# EasyEDA Pro project 前置放大.eprj

# Schematic Schematic1
Board Name: 前置差分放大; Create Date: 2024-09-15
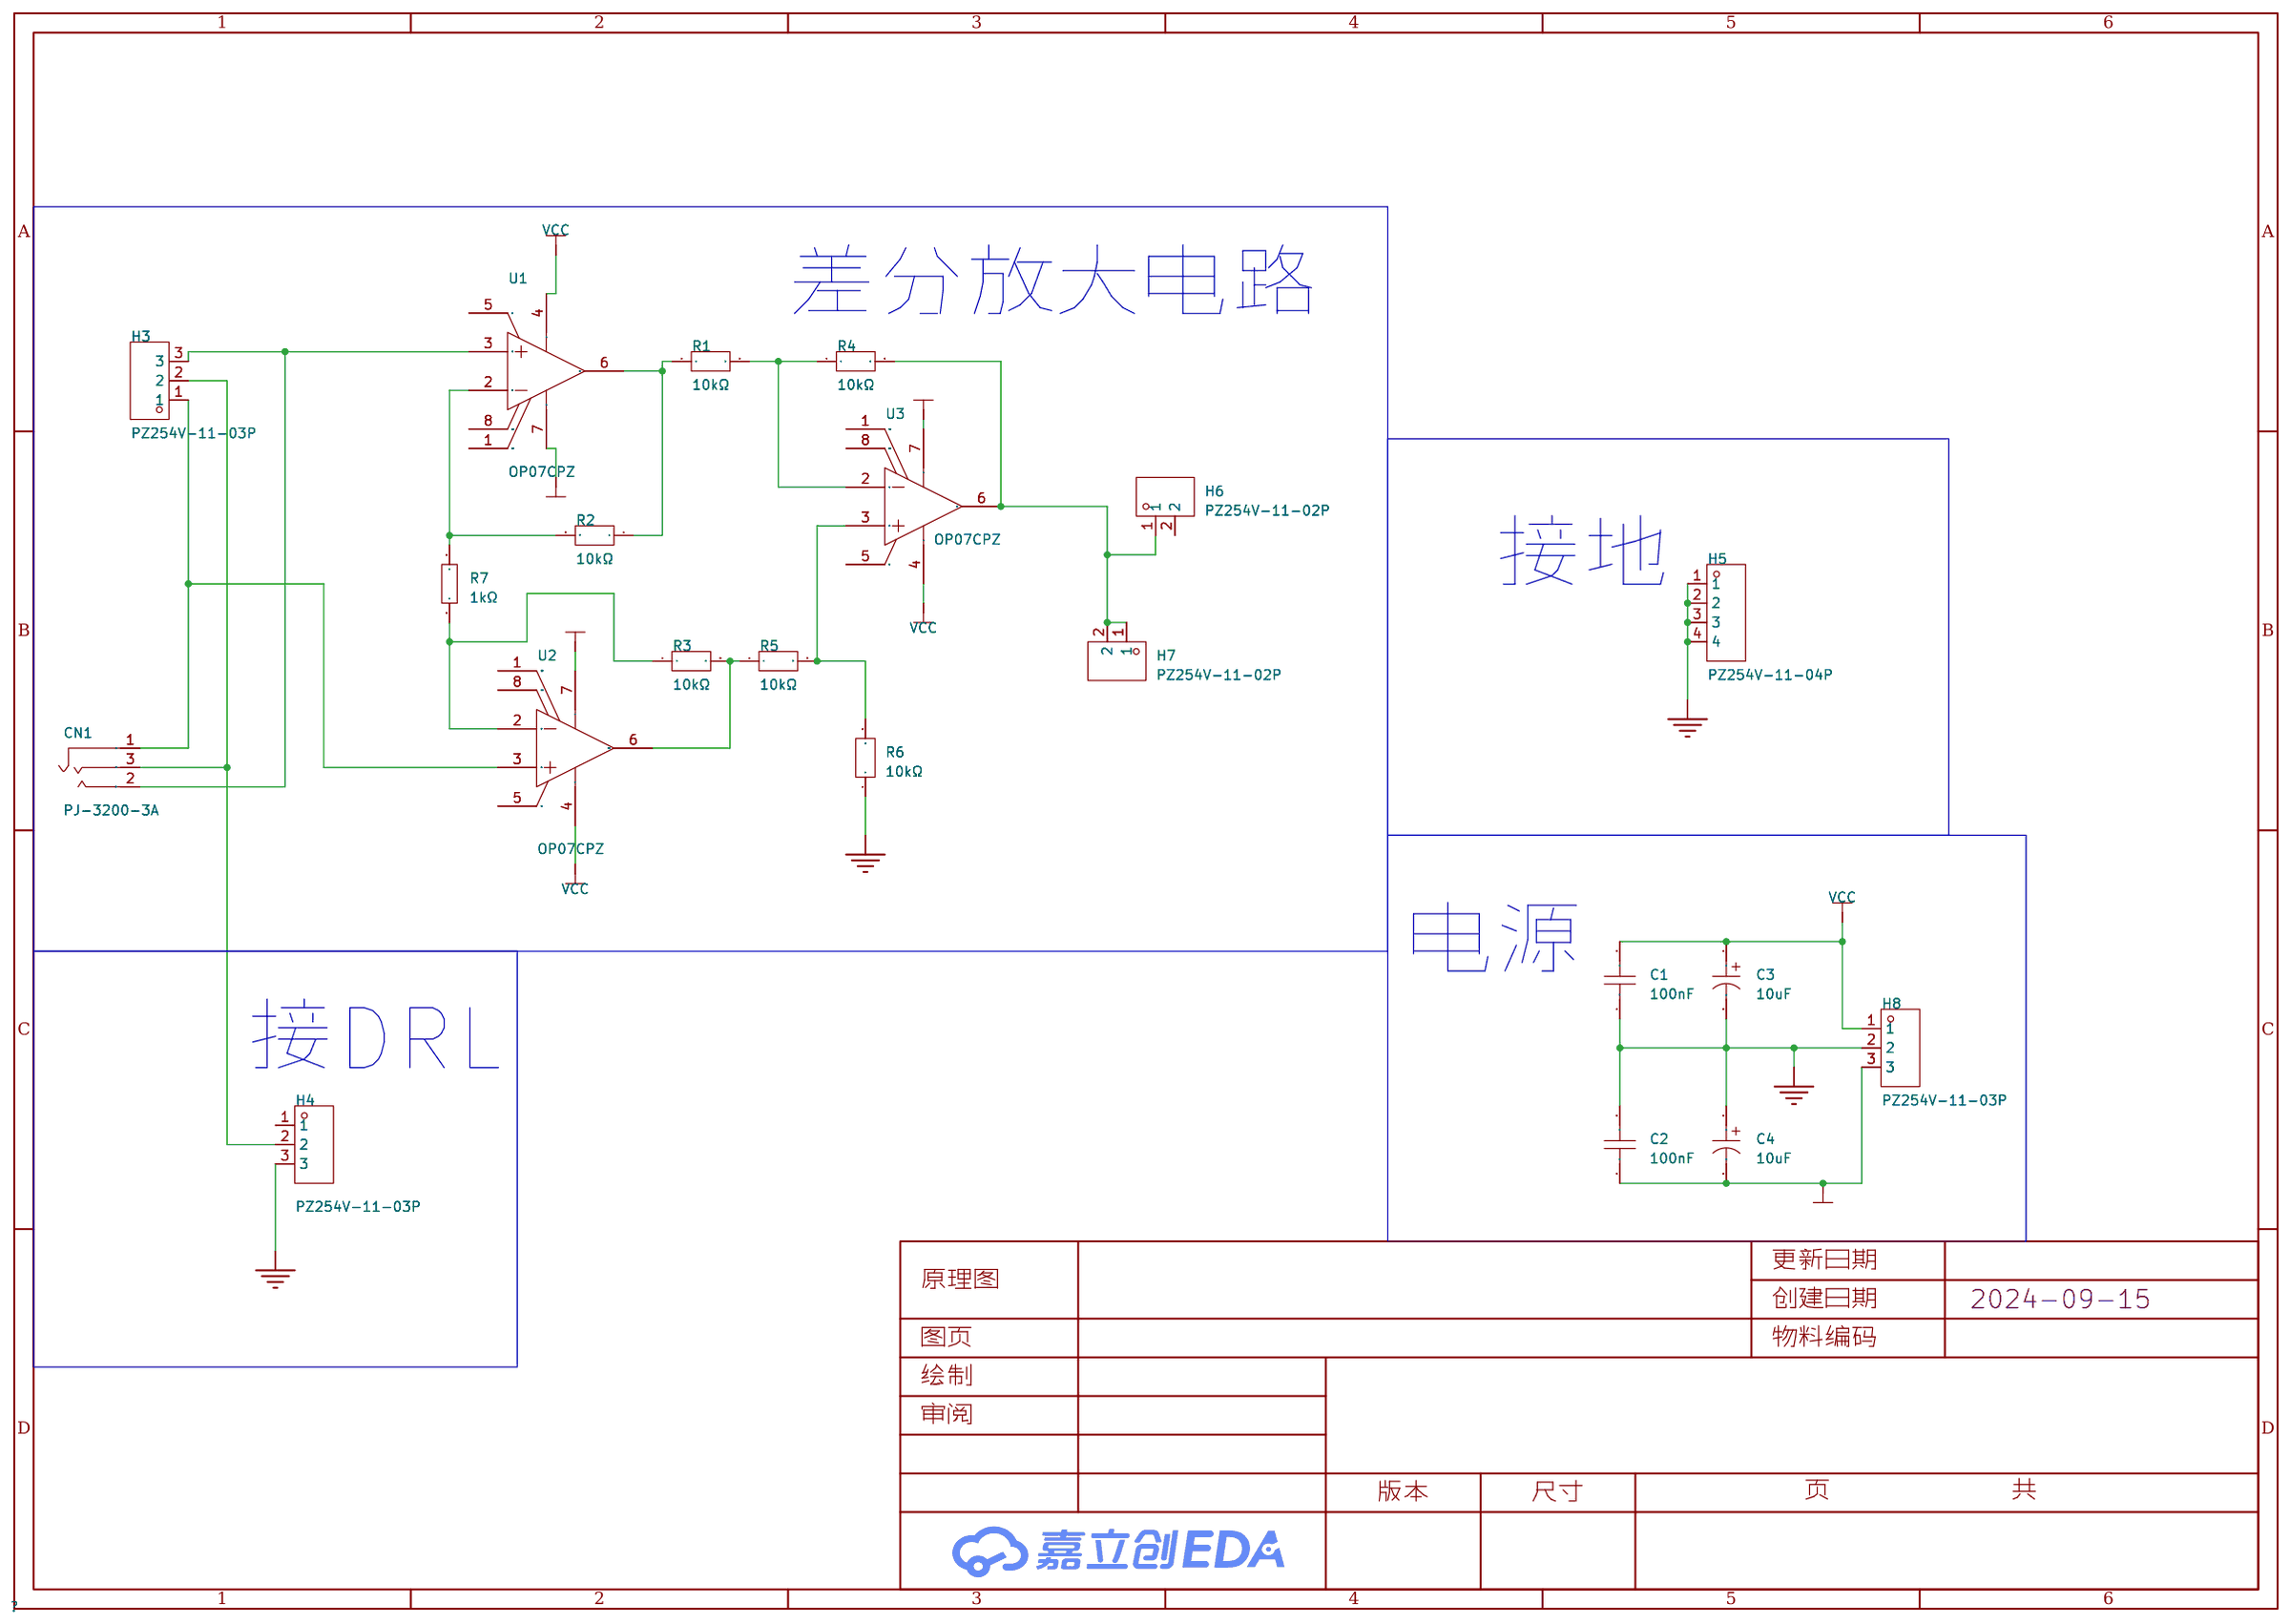
[diagram p0: schematic sheet]

## Parts
C1  100nF  [CAP-TH_L13.0-W6.0-P10.0-D0.6]
C2  100nF  [CAP-TH_L13.0-W6.0-P10.0-D0.6]
C3  10uF  [CAP-TH_BD10.0-P5.00-D0.6-FD]
C4  10uF  [CAP-TH_BD10.0-P5.00-D0.6-FD]
CN1  PJ-3200-3A  [AUDIO-TH_PJ-3200-3A]
H3  PZ254V-11-03P  [HDR-TH_3P-P2.54-V-M]
H4  PZ254V-11-03P  [HDR-TH_3P-P2.54-V-M]
H5  PZ254V-11-04P  [HDR-TH_4P-P2.54-V-M]
H6  PZ254V-11-02P  [HDR-TH_2P-P2.54-V-M]
H7  PZ254V-11-02P  [HDR-TH_2P-P2.54-V-M]
H8  PZ254V-11-03P  [HDR-TH_3P-P2.54-V-M]
R1  10kΩ  [RES-TH_BD2.4-L6.3-P10.30-D0.6]
R2  10kΩ  [RES-TH_BD2.4-L6.3-P10.30-D0.6]
R3  10kΩ  [RES-TH_BD2.4-L6.3-P10.30-D0.6]
R4  10kΩ  [RES-TH_BD2.4-L6.3-P10.30-D0.6]
R5  10kΩ  [RES-TH_BD2.4-L6.3-P10.30-D0.6]
R6  10kΩ  [RES-TH_BD2.4-L6.3-P10.30-D0.6]
R7  1kΩ  [RES-TH_BD2.5-L6.5-P10.50-D0.6]
U1  OP07CPZ  [PDIP-8_L9.3-W6.4-P2.54-LS7.6-BL]
U2  OP07CPZ  [PDIP-8_L9.3-W6.4-P2.54-LS7.6-BL]
U3  OP07CPZ  [PDIP-8_L9.3-W6.4-P2.54-LS7.6-BL]

## Library data of the parts
C1 C2 = 1X2H410K275-11: LCSC Part Name: 等级:X2 100nF ±10% 275V; Supplier Part: C2846731; Manufacturer: BM(丰明电容); Supplier Footprint: 插件,P=10mm; JLCPCB Part Class: 扩展库; Datasheet: https://atta.szlcsc.com/upload/public/pdf/source/20210728/C2846732_DAC16FCBF90FAF4BF667A23B36E0C6E8.pdf; Supplier: LCSC; Tolerance: ±10%; Voltage(AC): 275V; Subclass: X2
C3 C4 = UCS2E100MPD1TD: LCSC Part Name: 10uF ±20% 250V; Supplier Part: C1579721; Manufacturer: Nichicon(尼吉康); Supplier Footprint: 插件; JLCPCB Part Class: 扩展库; Datasheet: https://atta.szlcsc.com/upload/public/pdf/source/20211009/4F4CA769B8C92F768087E64A1413DB40.pdf; Supplier: LCSC; Tolerance: ±20%; Rated Voltage: 250V; Ripple Current: 175mA@120Hz; Lead Spacing: 5mm; φD: 10mm; Lifetime @ Temp: 8000hrs@105℃; Operating Temperature: -40℃~+105℃
CN1 = PJ-3200-3A: LCSC Part Name: 3.5mm耳机座; Supplier Part: C709202; Manufacturer: 韩国韩荣; Supplier Footprint: 插件; JLCPCB Part Class: 扩展库; Datasheet: https://atta.szlcsc.com/upload/public/pdf/source/20201012/C709202_4DD47C61DF91E6337EB1570AC409C882.pdf; Supplier: LCSC; Connector Type: 3.5mm耳机座; Current Rating (Max): 500mA; Voltage Rating (Max): 30V; Operating Temperature Range: -20℃~+70℃
H3 H4 H8 = PZ254V-11-03P: LCSC Part Name: 间距:2.54mm 1x3P 直插 方针; Supplier Part: C2937625; Manufacturer: XFCN(兴飞); Supplier Footprint: 插件,P=2.54mm; JLCPCB Part Class: 扩展库; Datasheet: https://atta.szlcsc.com/upload/public/pdf/source/20200309/C492402_8335C3D49C4E4C618838D59BB1D024C1.pdf; Supplier: LCSC; Pin Structure: 1x3P; Pitch: 2.54mm; Circluar Pins/Square Pins: 方针; Mounting Type: 直插; Number of Rows: 单排; Number of Pins: 3P; Current Rating (Max): 3A; Voltage Rating (Max): 250V; Length of Mating Pin: 6mm; Insulation Height: 2.5mm; Length of End Connection Pin: 3mm; Operating Temperature Range: -40℃~+105℃; Color: 黑色
H5 = PZ254V-11-04P: LCSC Part Name: 间距:2.54mm 1x4P 直插 方针; Supplier Part: C2691448; Manufacturer: XFCN(兴飞); Supplier Footprint: 插件,P=2.54mm; JLCPCB Part Class: 扩展库; Datasheet: https://atta.szlcsc.com/upload/public/pdf/source/20200309/C492403_F9F19131791D08044AD4F84F8E751A34.pdf; Supplier: LCSC; Pin Structure: 1x4P; Pitch: 2.54mm; Circluar Pins/Square Pins: 方针; Mounting Type: 直插; Number of Rows: 单排; Number of Pins: 4P; Current Rating (Max): 3A; Voltage Rating (Max): 250V; Length of Mating Pin: 6mm; Insulation Height: 2.5mm; Length of End Connection Pin: 3mm; Operating Temperature Range: -40℃~+105℃; Color: 黑色
H6 H7 = PZ254V-11-02P: LCSC Part Name: 间距:2.54mm 1x2P 直插 方针; Supplier Part: C492401; Manufacturer: XFCN(兴飞); Supplier Footprint: 插件,P=2.54mm; JLCPCB Part Class: 扩展库; Datasheet: https://atta.szlcsc.com/upload/public/pdf/source/20200309/C492401_A812433581A9B211A7FFA413ADDFF0E5.pdf; Supplier: LCSC; Pin Structure: 1x2P; Pitch: 2.54mm; Circluar Pins/Square Pins: 方针; Mounting Type: 直插; Number of Rows: 单排; Number of Pins: 2P; Length of Mating Pin: 6mm; Insulation Height: 2.5mm; Length of End Connection Pin: 3mm; Contact Material: 黄铜; Operating Temperature Range: -40℃~+105℃; Color: 黑色
R1-R6 = RN1/4W10KFT/BA1: LCSC Part Name: 10kΩ ±1% 250mW 金属膜电阻; Supplier Part: C410695; Manufacturer: Tyohm(幸亚电阻); Supplier Footprint: 插件,D2.4xL6.5mm; JLCPCB Part Class: 扩展库; Datasheet: https://atta.szlcsc.com/upload/public/pdf/source/20190808/C410699_D126E64D28B638F1D73B58E9F61DFD9B.pdf; Supplier: LCSC; Type: 金属膜电阻; Tolerance: ±1%; Overload Voltage (Max): 250V; Power(Watts): 250mW; Temperature Coefficient: ±50ppm/℃; Operating Temperature Range: -55℃~+125℃
R7 = MFR0W4F1001A50: LCSC Part Name: 1kΩ ±1% 250mW 金属膜电阻; Supplier Part: C57435; Manufacturer: UNI-ROYAL(厚声); Supplier Footprint: 插件,D2.2xL6.5mm; JLCPCB Part Class: 扩展库; Datasheet: https://atta.szlcsc.com/upload/public/pdf/source/20191012/C436293_8820AA14BC71FA35E551C06C441482A0.pdf; Supplier: LCSC; Type: 金属膜电阻; Tolerance: ±1%; Overload Voltage (Max): 250V; Power(Watts): 250mW; Temperature Coefficient: ±50ppm/℃
U1-U3 = OP07CPZ: Supplier Part: C408829; Manufacturer: ADI(亚德诺); Supplier Footprint: PDIP-8; JLCPCB Part Class: 扩展库; Datasheet: https://atta.szlcsc.com/upload/public/pdf/source/20190807/C408829_BE0F3A08CC30F779D7ED20D5AC7364F9.pdf; Supplier: LCSC

## Nets
GND: C1.1 C2.2 C3.2 C4.1 H4.3 H5.1 H5.2 H5.3 H5.4 H8.2 R6.1
VCC: C1.2 C3.1 H8.1 U1.4(V-) U2.4(V-) U3.4(V-)
VEE: C2.1 C4.2 H8.3 U1.7(V+) U2.7(V+) U3.7(V+)
$1N1148: CN1.2 H3.3 U1.3(IN+)
$1N1174: R3.1 R7.1 U2.2(IN-)
$1N1182: CN1.1 H3.1 U2.3(IN+)
$1N1311: R2.2 R7.2 U1.2(IN-)
$1N1319: R1.1 R2.1 U1.6(OUT)
$1N1379: R3.2 R5.1 U2.6(OUT)
$1N1397: R1.2 R4.1 U3.2(IN-)
$1N1420: R5.2 R6.2 U3.3(IN+)
$1N1452: H6.1 H7.1 H7.2 R4.2 U3.6(OUT)
$1N2211: CN1.3 H3.2 H4.2

Not connected (* = marked no-connect by the designer): H4 1; H6 2; U1 1(VOS_TRIM) 5(NC) 8(VOS_TRIM); U2 1(VOS_TRIM) 5(NC) 8(VOS_TRIM); U3 1(VOS_TRIM) 5(NC) 8(VOS_TRIM)

## Notes on the sheet
- 差分放大电路
- 接地
- 电源
- 接DRL

# Board PCB1
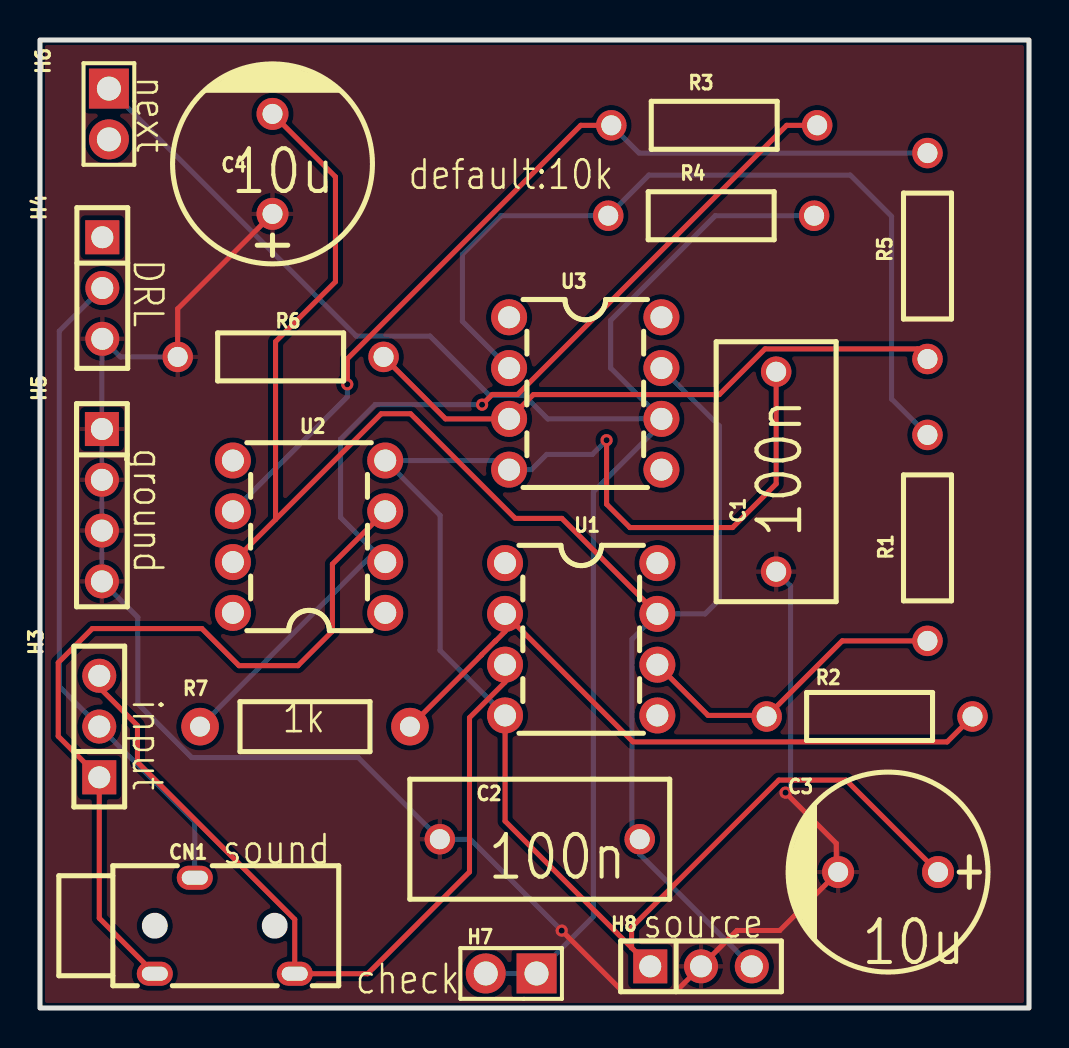
[diagram p1: board, top side]
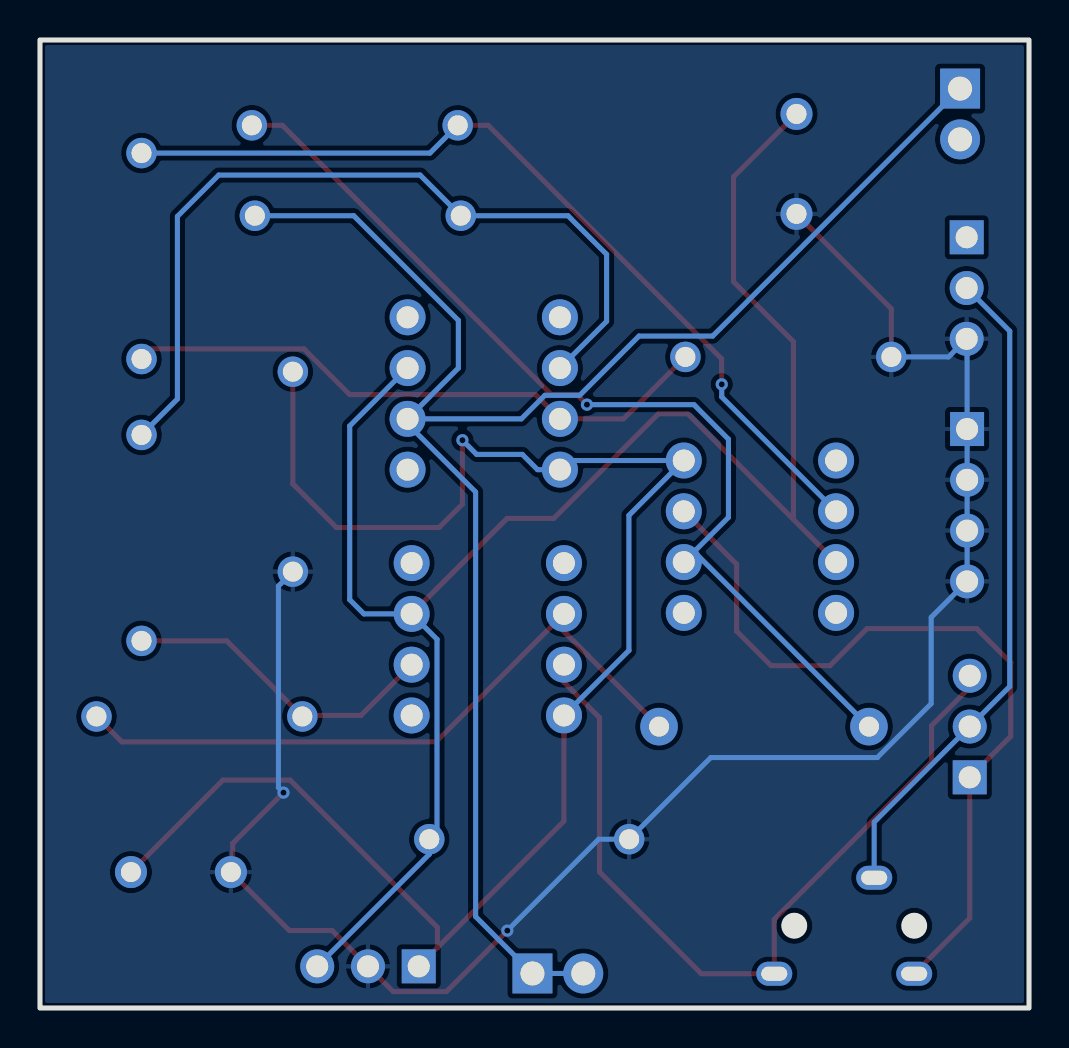
[diagram p2: board, bottom side, seen from below]

Outline 49.48 x 48.41 mm; copper layers: Top Layer, Bottom Layer. Coordinates in mm from the lower left corner of the outline.
Outline path: rectangle 0,48.41 49.48,0
Stack: Top Layer 0.035mm / Dielectric1 1.51mm FR4 er 4.5 / Bottom Layer 0.035mm

## Design rules (mm)
template: JLCPCB Capability(Two Layers Board)
spacing copperThickness1oz (default): track to track 0.102, other pairs 0.152 to 0.3
spacing copperThickness2oz: track to track 0.203, other pairs 0.152 to 0.3
track width copperThickness1oz (default): min 0.127, default 0.254, max 2.54
track width copperThickness2oz: min 0.203, default 0.254, max 2.54
differential pair differentialPair (default): width min 0.127, default 0.254, max 2.54; gap min 0.152, default 0.152
via viaSize (default): diameter min 0.5, default 0.61, max 10; hole min 0.3, default 0.305, max 6.3

## Placement (name value [footprint] x y rotation side)
C1  100nF  [CAP-TH_L13.0-W6.0-P10.0-D0.6]  36.83 26.82 90 top
C2  100nF  [CAP-TH_L13.0-W6.0-P10.0-D0.6]  25 8.44 180 top
C3  10uF  [CAP-TH_BD10.0-P5.00-D0.6-FD]  42.43 6.8 180 top
C4  10uF  [CAP-TH_BD10.0-P5.00-D0.6-FD]  11.63 42.22 90 top
CN1  PJ-3200-3A  [AUDIO-TH_PJ-3200-3A]  9.25 4.11 0 top
H3  PZ254V-11-03P  [HDR-TH_3P-P2.54-V-M]  2.97 14.08 90 top
H4  PZ254V-11-03P  [HDR-TH_3P-P2.54-V-M]  3.12 36.01 270 top
H5  PZ254V-11-04P  [HDR-TH_4P-P2.54-V-M]  3.1 25.15 270 top
H6  PZ254V-11-02P  [HDR-TH_2P-P2.54-V-M]  3.45 44.71 270 top
H7  PZ254V-11-02P  [HDR-TH_2P-P2.54-V-M]  23.57 1.73 180 top
H8  PZ254V-11-03P  [HDR-TH_3P-P2.54-V-M]  33.07 2.08 0 top
R1  10kΩ  [RES-TH_BD2.4-L6.3-P10.30-D0.6]  44.4 23.51 90 top
R2  10kΩ  [RES-TH_BD2.4-L6.3-P10.30-D0.6]  41.5 14.58 0 top
R3  10kΩ  [RES-TH_BD2.4-L6.3-P10.30-D0.6]  33.73 44.15 180 top
R4  10kΩ  [RES-TH_BD2.4-L6.3-P10.30-D0.6]  33.58 39.62 0 top
R5  10kΩ  [RES-TH_BD2.4-L6.3-P10.30-D0.6]  44.4 37.61 270 top
R6  10kΩ  [RES-TH_BD2.4-L6.3-P10.30-D0.6]  12.04 32.56 0 top
R7  1kΩ  [RES-TH_BD2.5-L6.5-P10.50-D0.6]  13.26 14.07 0 top
U1  OP07CPZ  [PDIP-8_L9.3-W6.4-P2.54-LS7.6-BL]  27.08 18.44 270 top
U2  OP07CPZ  [PDIP-8_L9.3-W6.4-P2.54-LS7.6-BL]  13.46 23.57 90 top
U3  OP07CPZ  [PDIP-8_L9.3-W6.4-P2.54-LS7.6-BL]  27.28 30.73 270 top

## Footprints (pads in the part's own frame, mm; a bottom-side part is the same pattern mirrored in y, then rotated)
AUDIO-TH_PJ-3200-3A
  oval 1.8x1.2 hole 1.3x0.7: 1(-3.5,-2.4) 2(3.5,-2.4) 3(-1.5,2.4)
CAP-TH_BD10.0-P5.00-D0.6-FD
  round 1.6 hole 1: 1(-2.5,0) 2(2.5,0)
CAP-TH_L13.0-W6.0-P10.0-D0.6
  round 1.524 hole 1: 1(-5,0) 2(5,0)
HDR-TH_2P-P2.54-V-M
  rect 2x2 hole 1.2: 1(-1.27,0)
  round 2 hole 1.2: 2(1.27,0)
HDR-TH_3P-P2.54-V-M
  rect 1.7x1.7 hole 1.1: 1(-2.54,0)
  round 1.7 hole 1.1: 2(0,0) 3(2.54,0)
HDR-TH_4P-P2.54-V-M
  rect 1.7x1.7 hole 1.1: 1(-3.81,0)
  round 1.7 hole 1.1: 2(-1.27,0) 3(1.27,0) 4(3.81,0)
PDIP-8_L9.3-W6.4-P2.54-LS7.6-BL
  round 1.8 hole 1.1: 1(-3.81,-3.81) 2(-1.27,-3.81) 3(1.27,-3.81) 4(3.81,-3.81) 5(3.81,3.81) 6(1.27,3.81) 7(-1.27,3.81) 8(-3.81,3.81)
RES-TH_BD2.4-L6.3-P10.30-D0.6
  round 1.524 hole 1: 1(-5.15,0) 2(5.15,0)
RES-TH_BD2.5-L6.5-P10.50-D0.6
  round 1.879 hole 1: 1(-5.25,0) 2(5.25,0)

## Nets
As in the schematic.

Pads without a net: H4 1; H6 2; U1 1 5 8; U2 1 5 8; U3 1 5 8

## Via types
v1: diameter 0.61, hole 0.305, Top Layer to Bottom Layer, 5 vias

## Routing (per net, layer and track width the routed paths; a pad name or vN(x,y) marks a point on that pad's centre or on a via; arc(x,y) is an arc through that point)
GND: length 92.3
  Top Layer w0.254: R6.1 6.89,34.97 C4.1 ; v1(26.1,3.87) 29.15,0.82 31.81,0.82 H8.2 34.87,3.88 37.01,3.88 39.84,6.71 ; 39.84,6.71 C3.2 ; 39.84,6.71 39.84,8.23 v1(37.3,10.77)
  Bottom Layer w0.254: R6.1 4.02,32.56 H4.3 3.1,33.45 H5.1 H5.2 H5.3 H5.4 4.89,19.54 4.89,15.22 7.59,12.53 15.92,12.53 C2.2 21.53,8.44 v1(26.1,3.87) ; v1(37.3,10.77) 37.55,11.03 37.55,21.1 C1.1
VCC: length 82.7
  Top Layer w0.254: 29.6,3.02 23.27,9.35 U1.4 ; 29.6,3.02 29.6,4.03 36.96,11.4 40.33,11.4 C3.1 ; 29.6,3.02 H8.1 ; v1(28.35,28.4) 28.35,25.2 29.52,24.03 34.65,24.03 36.83,26.21 C1.2
  Bottom Layer w0.254: v1(28.35,28.4) 27.64,27.69 25.35,27.69 24.59,26.92 U3.4 23.01,27.38 U2.4 20.02,24.64 20.02,17.88 U1.4
VEE: length 88.1
  Top Layer w0.254: 11.79,24.44 11.79,33.33 14.78,36.32 14.78,41.57 C4.2 ; 11.79,24.44 U2.7 ; 11.79,24.44 17.07,29.72 18.54,29.72 23.77,24.49 26.11,24.49 U1.7
  Bottom Layer w0.254: U3.7 33.99,29.11 33.99,20.42 33.27,19.71 U1.7 29.62,18.44 29.62,8.83 C2.1 30,7.69 H8.3
$1N1148: length 40.9
  Top Layer w0.254: U1.3 23.27,16.3 21.49,14.52 21.49,6.81 16.4,1.72 CN1.2 12.75,4.43 4.88,12.3 4.88,14.12 2.97,16.03 H3.3
$1N1174: length 49.8
  Top Layer w0.254: v1(22.12,30.18) 22.63,30.68 23.9,30.68 37.36,44.15 R3.1
  Bottom Layer w0.254: 16.74,22.83 U2.2 ; 16.74,22.83 15.04,24.54 15.04,28.45 16.76,30.18 v1(22.12,30.18) ; 16.74,22.83 16.74,22.8 R7.1
$1N1182: length 40.6
  Top Layer w0.254: U2.3 14.63,22.2 14.63,18.85 12.9,17.12 9.96,17.12 8.1,18.98 2.62,18.98 0.91,17.27 0.91,13.59 H3.1 2.97,4.49 CN1.1
$1N1311: length 34.2
  Top Layer w0.254: R2.2 45.38,13.31 29.67,13.31 U1.2 23.27,18.83 22.79,18.35 22.78,18.35 22.09,17.66 22.09,17.65 R7.2
$1N1319: length 16.2
  Top Layer w0.254: 36.41,14.63 40.14,18.36 R1.1 ; 36.41,14.63 R2.1 ; 36.41,14.63 33.42,14.63 U1.6
$1N1379: length 44.4
  Top Layer w0.254: 28.58,44.15 27.06,44.15 15.38,32.47 v1(15.37,31.19)
  Bottom Layer w0.254: R5.1 29.97,42.76 28.58,44.15 ; U2.6 15.37,30.56 v1(15.37,31.19)
$1N1397: length 42.3
  Bottom Layer w0.254: R1.2 42.6,30.46 42.6,39.59 40.54,41.66 30.46,41.66 R4.1 23.06,39.62 21.13,37.69 21.13,34.34 U3.2
$1N1420: length 30.2
  Top Layer w0.254: R6.2 20.29,29.46 U3.3 24.68,30.68 33.99,30.68 36.27,32.97 43.89,32.97 R5.2
$1N1452: length 85.6
  Bottom Layer w0.254: 30.92,29.46 U3.6 28.55,32 28.55,34.39 33.78,39.62 R4.2 ; 30.92,29.46 25.4,29.46 24.22,30.64 22.48,30.64 19.51,33.6 15.83,33.6 H6.1 ; 30.92,29.46 30.92,29.04 27.69,25.81 27.69,4.57 H7.1 H7.2
$1N2211: length 33.2
  Bottom Layer w0.254: CN1.3 7.75,9.3 H3.2 0.97,16.08 0.97,33.85 H4.2

## Copper pours and planes (outline as drawn; the poured copper is in the pictures)
GND on Top Layer: 0.05,48.97 49.43,48.97 49.43,-0.15 0.05,-0.15
GND on Top Layer: 0,48.73 49.43,48.73 49.43,-0.15 0,-0.15
GND on Top Layer: 0.46,48.56 49.36,48.56 49.36,-0.05 0.46,-0.05
GND on Bottom Layer: 0,48.21 49.48,48.21 49.48,0 0,0
GND on Bottom Layer: 0.26,48.41 49.3,48.41 49.3,0 0.26,0

## Text on the board
Top Silkscreen Layer: sound | 1k | check | default:10k | source | input | DRL | next | ground | 10u | 100n
